# Altium schematic sheet Digital_Input_CPU.SchDoc: TTL IO Interface for External I/O
size Tabloid; Date: 03/13/2023; Engineer: Terry D. Schevker; Revision: 1,0; SheetNumber: 2; SheetTotal: 3
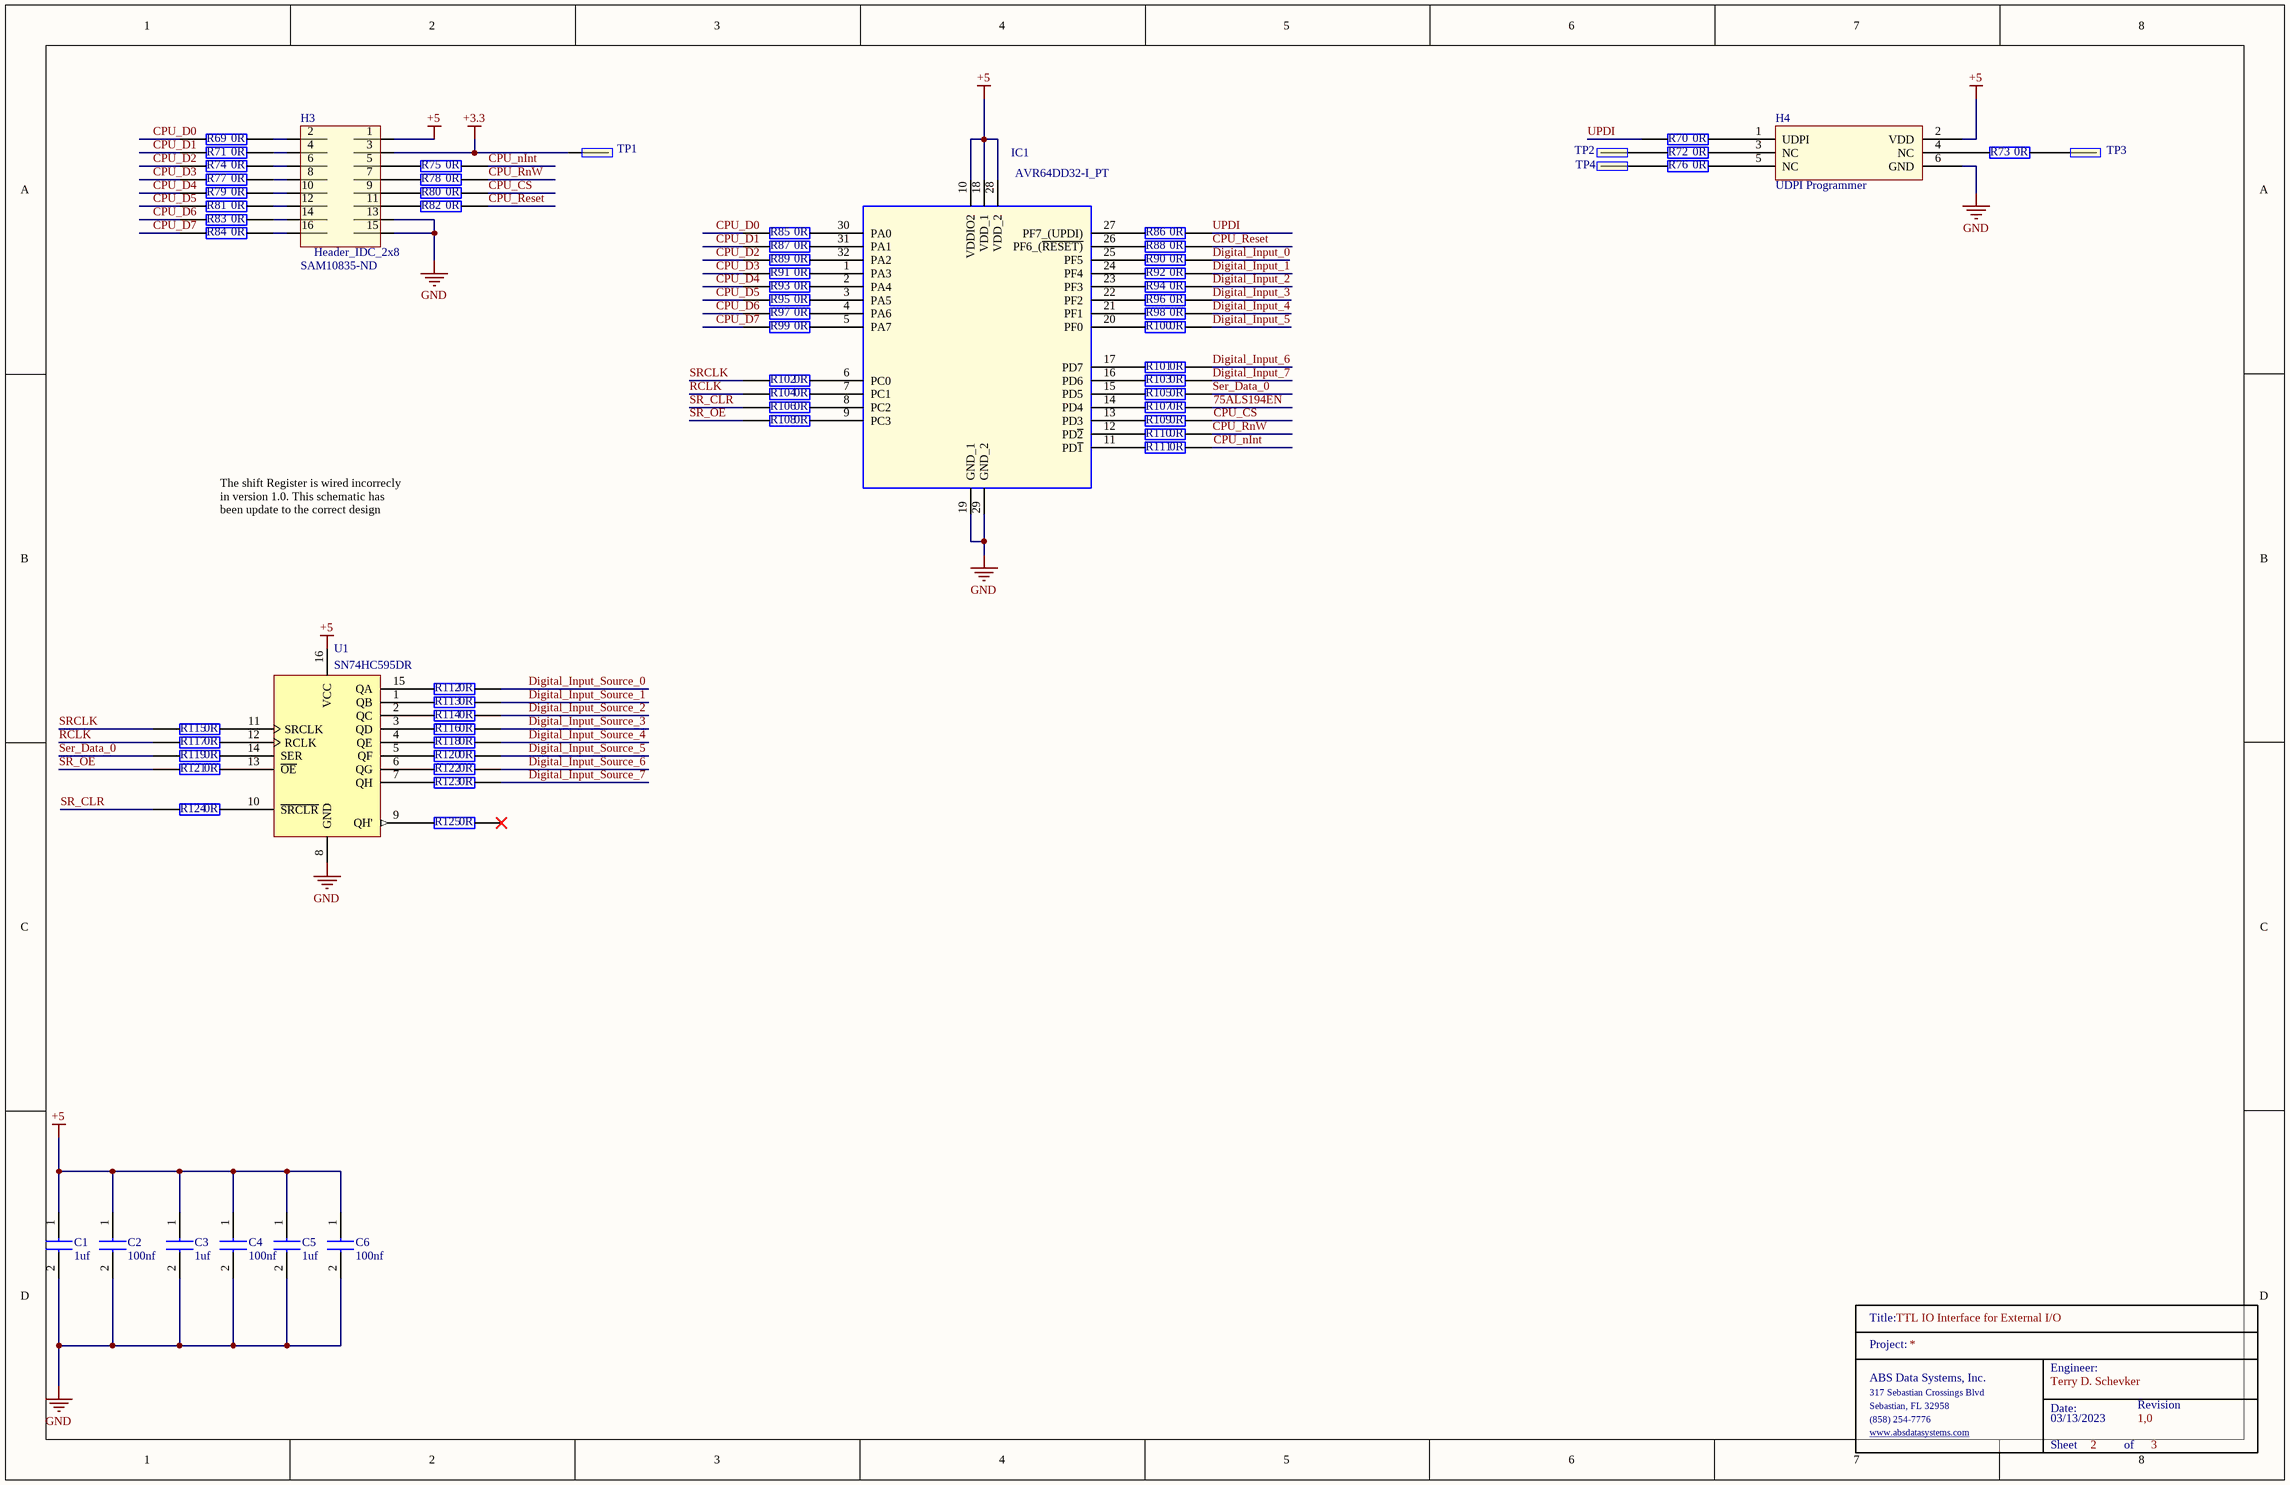
[diagram p0: Digital_Input_CPU.SchDoc]

## Parts
C1  1uf  [0603]
C2  100nf  [0603]
C3  1uf  [0603]
C4  100nf  [0603]
C5  1uf  [0603]
C6  100nf  [0603]
H3  Header_IDC_2x8  Supplier Part Number 1: SAM10835-ND  [HEADER16]
H4  UDPI Programmer  [HDR2X3]
IC1  AVR64DD32-I_PT  [QFP80P900X900X120-32N]
R69  0R  [0603]
R70  0R  [0603]
R71  0R  [0603]
R72  0R  [0603]
R73  0R  [0603]
R74  0R  [0603]
R75  0R  [0603]
R76  0R  [0603]
R77  0R  [0603]
R78  0R  [0603]
R79  0R  [0603]
R80  0R  [0603]
R81  0R  [0603]
R82  0R  [0603]
R83  0R  [0603]
R84  0R  [0603]
R85  0R  [0603]
R86  0R  [0603]
R87  0R  [0603]
R88  0R  [0603]
R89  0R  [0603]
R90  0R  [0603]
R91  0R  [0603]
R92  0R  [0603]
R93  0R  [0603]
R94  0R  [0603]
R95  0R  [0603]
R96  0R  [0603]
R97  0R  [0603]
R98  0R  [0603]
R99  0R  [0603]
R100  0R  [0603]
R101  0R  [0603]
R102  0R  [0603]
R103  0R  [0603]
R104  0R  [0603]
R105  0R  [0603]
R106  0R  [0603]
R107  0R  [0603]
R108  0R  [0603]
R109  0R  [0603]
R110  0R  [0603]
R111  0R  [0603]
R112  0R  [0603]
R113  0R  [0603]
R114  0R  [0603]
R115  0R  [0603]
R116  0R  [0603]
R117  0R  [0603]
R118  0R  [0603]
R119  0R  [0603]
R120  0R  [0603]
R121  0R  [0603]
R122  0R  [0603]
R123  0R  [0603]
R124  0R  [0603]
R125  0R  [0603]
TitleBlock_1  TitleBlock  (value not drawn)  (graphical)
TP1  TP  [TP]  (value not drawn)
TP2  TP  [TP]  (value not drawn)
TP3  TP  [TP]  (value not drawn)
TP4  TP  [TP]  (value not drawn)
U1  SN74HC595DR  [SOIC_16_Narrow]

## Nets
+3.3: H3.3 TP1.1
+5: C1.1 C2.1 C3.1 C4.1 C5.1 C6.1 H3.1 H4.2(VDD) IC1.10(VDDIO2) IC1.18(VDD_1) IC1.28(VDD_2) U1.16(VCC)
GND: C1.2 C2.2 C3.2 C4.2 C5.2 C6.2 H3.13 H3.15 H4.6(GND) IC1.19(GND_1) IC1.29(GND_2) U1.8(GND)
75ALS194EN: R107.2
CPU_CS: R80.2 R109.2
CPU_D0: R69.1 R85.1
CPU_D1: R71.1 R87.1
CPU_D2: R74.1 R89.1
CPU_D3: R77.1 R91.1
CPU_D4: R79.1 R93.1
CPU_D5: R81.1 R95.1
CPU_D6: R83.1 R97.1
CPU_D7: R84.1 R99.1
CPU_nInt: R75.2 R111.2
CPU_Reset: R82.2 R88.2
CPU_RnW: R78.2 R110.2
Digital_Input_0: R90.2
Digital_Input_1: R92.2
Digital_Input_2: R94.2
Digital_Input_3: R96.2
Digital_Input_4: R98.2
Digital_Input_5: R100.2
Digital_Input_6: R101.2
Digital_Input_7: R103.2
Digital_Input_Source_0: R112.2
Digital_Input_Source_1: R113.2
Digital_Input_Source_2: R114.2
Digital_Input_Source_3: R116.2
Digital_Input_Source_4: R118.2
Digital_Input_Source_5: R120.2
Digital_Input_Source_6: R122.2
Digital_Input_Source_7: R123.2
RCLK: R104.1 R117.1
Ser_Data_0: R105.2 R119.1
SR_CLR: R106.1 R124.1
SR_OE: R108.1 R121.1
SRCLK: R102.1 R115.1
UPDI: R70.1 R86.2
NetH3_2: H3.2 R69.2
NetH3_4: H3.4 R71.2
NetH3_5: H3.5 R75.1
NetH3_6: H3.6 R74.2
NetH3_7: H3.7 R78.1
NetH3_8: H3.8 R77.2
NetH3_9: H3.9 R80.1
NetH3_10: H3.10 R79.2
NetH3_11: H3.11 R82.1
NetH3_12: H3.12 R81.2
NetH3_14: H3.14 R83.2
NetH3_16: H3.16 R84.2
NetH4_1: H4.1(UDPI) R70.2
NetH4_3: H4.3(NC) R72.2
NetH4_4: H4.4(NC) R73.1
NetH4_5: H4.5(NC) R76.2
NetIC1_1: IC1.1(PA3) R91.2
NetIC1_2: IC1.2(PA4) R93.2
NetIC1_3: IC1.3(PA5) R95.2
NetIC1_4: IC1.4(PA6) R97.2
NetIC1_5: IC1.5(PA7) R99.2
NetIC1_6: IC1.6(PC0) R102.2
NetIC1_7: IC1.7(PC1) R104.2
NetIC1_8: IC1.8(PC2) R106.2
NetIC1_9: IC1.9(PC3) R108.2
NetIC1_11: IC1.11(PD~{1}) R111.1
NetIC1_12: IC1.12(PD~{2}) R110.1
NetIC1_13: IC1.13(PD3) R109.1
NetIC1_14: IC1.14(PD4) R107.1
NetIC1_15: IC1.15(PD5) R105.1
NetIC1_16: IC1.16(PD6) R103.1
NetIC1_17: IC1.17(PD7) R101.1
NetIC1_20: IC1.20(PF0) R100.1
NetIC1_21: IC1.21(PF1) R98.1
NetIC1_22: IC1.22(PF2) R96.1
NetIC1_23: IC1.23(PF3) R94.1
NetIC1_24: IC1.24(PF4) R92.1
NetIC1_25: IC1.25(PF5) R90.1
NetIC1_26: IC1.26(PF6_(~{RESET)}) R88.1
NetIC1_27: IC1.27(PF7_(UPDI)) R86.1
NetIC1_30: IC1.30(PA0) R85.2
NetIC1_31: IC1.31(PA1) R87.2
NetIC1_32: IC1.32(PA2) R89.2
NetR72_1: R72.1 TP2.1
NetR73_2: R73.2 TP3.1
NetR76_1: R76.1 TP4.1
NetR112_1: R112.1 U1.15(QA)
NetR113_1: R113.1 U1.1(QB)
NetR114_1: R114.1 U1.2(QC)
NetR115_2: R115.2 U1.11(SRCLK)
NetR116_1: R116.1 U1.3(QD)
NetR117_2: R117.2 U1.12(RCLK)
NetR118_1: R118.1 U1.4(QE)
NetR119_2: R119.2 U1.14(SER)
NetR120_1: R120.1 U1.5(QF)
NetR121_2: R121.2 U1.13(~{OE})
NetR122_1: R122.1 U1.6(QG)
NetR123_1: R123.1 U1.7(QH)
NetR124_2: R124.2 U1.10(~{SRCLR})
NetR125_1: R125.1 U1.9(QH')

Not connected (* = marked no-connect by the designer): R125 2*

## Notes on the sheet
- The shift Register is wired incorrecly in version 1.0. This schematic has been update to the correct design
- (in symbol TitleBlock) Title:; Project:; Engineer:; ABS Data Systems, Inc.; 317 Sebastian Crossings Blvd; Sebastian, FL 32958; Date:; Revision; (858) 254-7776; www.absdatasystems.com; Sheet; of

## Library data of the parts
C1 C3 C5 = CL10B105KA8NNNL: Samsung Electro-Mechanics 0603 1uf
C2 C4 C6 = CL10B104JB8NNNC: Samsung Electro-Mechanics 0603 100nf
H3 = Header_IDC_2x8: 16 Pin 2x8 Through Hold IDC Connector; Manufacturer: Samtec; Manufacturer Part Number: TST-108-01-G-D; Number of Contacts: 16; Gender: Male; Connector Type: Male Pin; Pitch: 2.54mm; Row Spacing: 0.1inch; Supplier 1: Digi-Key; RoHS: Yes; Category: Headers and Wire Housings; Stock 1: 227; Pricing 1: 1=2.85000, 10=2.73600, 100=2.28000, 500=1.93800, 1000=1.65300, 5000=1.48200 (USD); Mount: Through Hole; Contact Plating: Gold; Contact Material: Bronze; Housing Material: Polyester; Housing Color: Black; Color: Black; Min Operating Temperature: -55°C; Max Operating Temperature: 125°C; Number of Rows: 2; Termination: Solder; Packaging: Rail/Tube; Orientation: Straight; Number of Positions: 16; Length: 27.94mm; Depth: 9.27mm; Contact Mating Length: 0.25inch; REACH SVHC: No SVHC; ComponentLink1URL: https://datasheet.ciiva.com/739/tst-mkt-739845.pdf?src-supplier=Digi-Key; ComponentLink1Description: https://datasheet.ciiva.com/739/tst-mkt-739845.pdf?src-supplier=Digi-Key; ComponentLink2URL: https://datasheet.ciiva.com/10018/htst-10018510.pdf?src-supplier=Avnet; ComponentLink2Description: https://datasheet.ciiva.com/10018/htst-10018510.pdf?src-supplier=Avnet
H4 = UDPI Programmer: 6 Pin 2X3 Through Hole Header
IC1 = AVR64DD32-I_PT: Integrated Circuit; Manufacturer_Name: Microchip; Manufacturer_Part_Number: AVR64DD32-I/PT | MULTI-VOLTAGE I/O; Datasheet Link: https://www.microchip.com/en-us/product/AVR64DD32; Height: 1.2mm
R69-R125 = RC0603JR-070RL: YAGEO 0603 0 ohm; Manufacturer_Name: KEMET; Geometry.Height: 0.55mm; Mouser Part Number: 603-RC0603JR-070RL; Mouser Price/Stock: https://www.mouser.co.uk/ProductDetail/YAGEO/RC0603JR-070RL?qs=2cAdsCoAWRGWyPcuXgGiXQ%3D%3D; Manufacturer_Part_Number: RC0603JR-070RL; Datasheet Link: https://datasheet.datasheetarchive.com/originals/distributors/Datasheets_SAMA/902f9e387b938f871d31120f5fc1d65e.pdf
TP1-TP4 = TP: Manufacturer: Samtec; Manufacturer Part Number: TST-105-01-G-D; Number of Contacts: 16; Gender: Male; Connector Type: Male Pin; Pitch: 2.54mm; Row Spacing: 0.1inch; Supplier 1: Digi-Key; RoHS: Yes; Category: Headers and Wire Housings; Stock 1: 227; Pricing 1: 1=2.85000, 10=2.73600, 100=2.28000, 500=1.93800, 1000=1.65300, 5000=1.48200 (USD); Mount: Through Hole; Contact Plating: Gold; Contact Material: Bronze; Housing Material: Polyester; Housing Color: Black; Color: Black; Min Operating Temperature: -55°C; Max Operating Temperature: 125°C; Number of Rows: 2; Termination: Solder; Packaging: Rail/Tube; Orientation: Straight; Number of Positions: 16; Length: 27.94mm; Depth: 9.27mm; Contact Mating Length: 0.25inch; REACH SVHC: No SVHC; ComponentLink1URL: https://datasheet.ciiva.com/739/tst-mkt-739845.pdf?src-supplier=Digi-Key; ComponentLink1Description: https://datasheet.ciiva.com/739/tst-mkt-739845.pdf?src-supplier=Digi-Key; ComponentLink2URL: https://datasheet.ciiva.com/10018/htst-10018510.pdf?src-supplier=Avnet; ComponentLink2Description: https://datasheet.ciiva.com/10018/htst-10018510.pdf?src-supplier=Avnet
U1 = SN74HC595DR: 8-Bit Shift Registers With 3-State Output Registers, D0016A, LARGE T&R; Manufacturer: Texas Instruments; Output Drive (IOL/IOH)(Max)(mA): 7.8/-7.8; Rating: Military; ICC @ Nom Voltage(Max)(mA): 0.08; VCC(Min)(V): 2; tpd @ Nom Voltage(Max)(ns): 34; 3-State Output: Yes; Output Type: CMOS; Voltage(Nom)(V): 6; F @ Nom Voltage(Max)(Mhz): 28; Technology Family: HC; Bits: 4; Max Supply Voltage: 6V; Min Supply Voltage: 2V; Propagation Delay: 250ns; Number of Elements: 1; Number of Output Lines: 10; Direction: Unidirectional; Number of Bits: 8; Quiescent Current: 8uA; Operating Supply Voltage: 5V; Frequency: 42MHz; Max Input Current: 1uA; PackageReference: D0016A; Code_JEDEC: MS-012 variation AC; Generic Part Number: SN74HC595; Operating Temperature Range(C): -40 to 85; DatasheetVersion: SCLS041H; PackageVersion: http://www.ti.com/lit/ml/mpds178g/mpds178g.pdf; Input Type: CMOS; VCC(Max)(V): 6; Supplier 1: Digi-Key; Supplier Part Number 1: 296-14857-1-ND; Manufacturer Part Number: SN74HC595DR; Stock 1: 38406; Pricing 1: 1=0.51000, 10=0.43300, 100=0.32300, 500=0.25380, 1000=0.19611 (USD); RoHS: Yes; Mount: Surface Mount; Case/Package: SOIC; Number of Pins: 16; Weight: 0.004998oz; Contact Plating: Gold; Min Operating Temperature: -40°C; Max Operating Temperature: 85°C; Packaging: Tape and Reel; Package Quantity: 2500; Logic Function: Shift Register; Number of Circuits: 4; Number of Bits per Element: 8; Turn-On Delay Time: 250ns; Termination: SMD/SMT; Length: 9.9mm; Height: 1.58mm; Width: 3.91mm; Radiation Hardening: No; REACH SVHC: No SVHC; Lead Free: Lead Free; ComponentLink1URL: https://datasheet.ciiva.com/15093/getdatasheetpartid-134875-15093436.pdf?src-supplier=Verical; ComponentLink1Description: https://datasheet.ciiva.com/15093/getdatasheetpartid-134875-15093436.pdf?src-supplier=Verical; ComponentLink2URL: https://datasheet.ciiva.com/22696/1831198-22696812.pdf?src-supplier=Element14; ComponentLink2Description: https://datasheet.ciiva.com/22696/1831198-22696812.pdf?src-supplier=Element14; ComponentLink3URL: https://datasheet.ciiva.com/34301/916385-34301758.pdf?src-supplier=Jameco; ComponentLink3Description: https://datasheet.ciiva.com/34301/916385-34301758.pdf?src-supplier=Jameco; ComponentLink4URL: https://datasheet.ciiva.com/26866/sn74hc595dr-26866161.pdf?src-supplier=IIIC; ComponentLink4Description: https://datasheet.ciiva.com/26866/sn74hc595dr-26866161.pdf?src-supplier=IIIC; ComponentLink5URL: https://datasheet.ciiva.com/1886/sn74hc595-1886279.pdf?src-supplier=Digi-Key; ComponentLink5Description: https://datasheet.ciiva.com/1886/sn74hc595-1886279.pdf?src-supplier=Digi-Key; ComponentLink6URL: https://datasheet.ciiva.com/1886/sn74hc595-1886280.pdf?src-supplier=Digi-Key; ComponentLink6Description: https://datasheet.ciiva.com/1886/sn74hc595-1886280.pdf?src-supplier=Digi-Key; ComponentLink7URL: https://datasheet.ciiva.com/1886/sn74hc595-1886281.pdf?src-supplier=Digi-Key; ComponentLink7Description: https://datasheet.ciiva.com/1886/sn74hc595-1886281.pdf?src-supplier=Digi-Key; ComponentLink8URL: https://datasheet.ciiva.com/1509/1831198-1509483.pdf?src-supplier=Element14; ComponentLink8Description: https://datasheet.ciiva.com/1509/1831198-1509483.pdf?src-supplier=Element14; ComponentLink9URL: https://datasheet.ciiva.com/46381/1886142-46381835.pdf?src-supplier=Element14; ComponentLink9Description: https://datasheet.ciiva.com/46381/1886142-46381835.pdf?src-supplier=Element14; ComponentLink10URL: https://datasheet.ciiva.com/14294/sn74hc595-14294989.pdf?src-supplier=Avnet; ComponentLink10Description: https://datasheet.ciiva.com/14294/sn74hc595-14294989.pdf?src-supplier=Avnet; ComponentLink11URL: https://datasheet.ciiva.com/14294/sn74hc595-14294991.pdf?src-supplier=Avnet; ComponentLink11Description: https://datasheet.ciiva.com/14294/sn74hc595-14294991.pdf?src-supplier=Avnet; ComponentLink12URL: https://datasheet.ciiva.com/46435/1831198-46435871.pdf?src-supplier=Element14; ComponentLink12Description: https://datasheet.ciiva.com/46435/1831198-46435871.pdf?src-supplier=Element14